# Altium schematic sheet power.SchDoc: Daughterboard Power
size A; DrawnBy: Mike Mozingo; Engineer: Mike Mozingo; Revision: 1
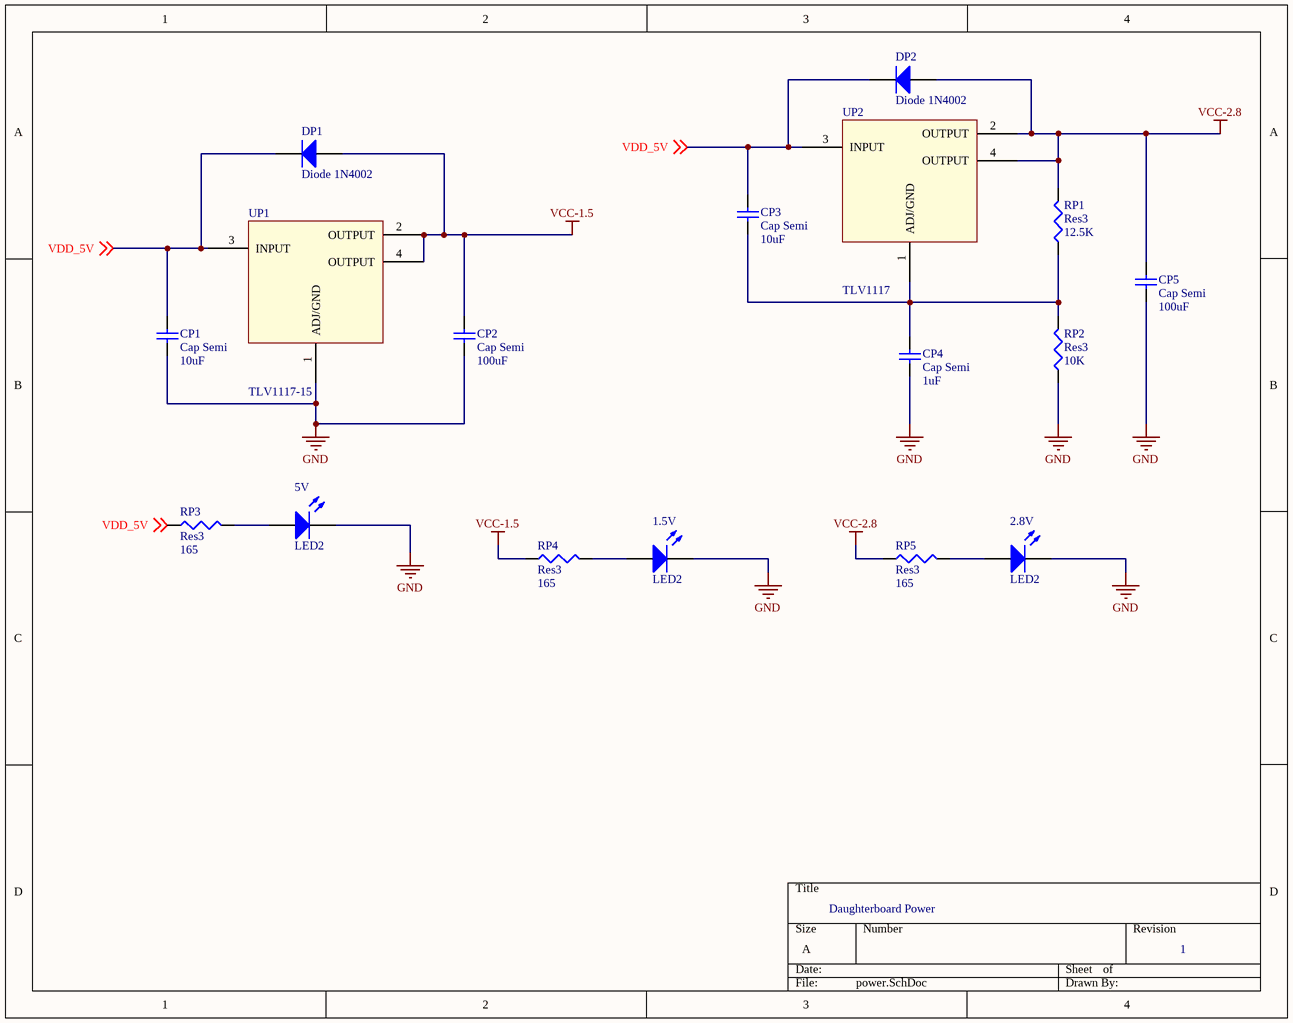
[diagram p0: power.SchDoc]

## Parts
1.5V  LED2  [DIODE1608]
2.8V  LED2  [DIODE1608]
5V  LED2  [DIODE1608]
CP1  Cap Semi  value 10uF  [CAPC1608L]
CP2  Cap Semi  value 100uF  [CAPC1608L]
CP3  Cap Semi  value 10uF  [CAPC1608L]
CP4  Cap Semi  value 1uF  [CAPC1608L]
CP5  Cap Semi  value 100uF  [CAPC1608L]
DP1  Diode 1N4002  [DIO10.46-5.3x2.8]
DP2  Diode 1N4002  [DIO10.46-5.3x2.8]
RP1  Res3  value 12.5K  [RESC1608L]
RP2  Res3  value 10K  [RESC1608L]
RP3  Res3  value 165  [RESC1608L]
RP4  Res3  value 165  [RESC1608L]
RP5  Res3  value 165  [RESC1608L]
UP1  TLV1117-15  [TLV1117-DCY]
UP2  TLV1117  [TLV1117-DCY]

## Nets
GND: 1.5V.2(K) 2.8V.2(K) 5V.2(K) CP1.1 CP2.1 CP4.1 CP5.1 RP2.1 UP1.1(ADJ/GND)
VCC-1.5: CP2.2 DP1.1(A) RP4.1 UP1.2(OUTPUT) UP1.4(OUTPUT)
VCC-2.8: CP5.2 DP2.1(A) RP1.2 RP5.1 UP2.2(OUTPUT) UP2.4(OUTPUT)
VDD_5V: CP1.2 CP3.2 DP1.2(K) DP2.2(K) RP3.1 UP1.3(INPUT) UP2.3(INPUT) ; off-sheet VDD_5V
Net1.5V_1: 1.5V.1(A) RP4.2
Net2.8V_1: 2.8V.1(A) RP5.2
Net5V_1: 5V.1(A) RP3.2
NetCP3_1: CP3.1 CP4.2 RP1.1 RP2.2 UP2.1(ADJ/GND)

## Library data of the parts
1.5V 2.8V 5V = LED2: Typical RED, GREEN, YELLOW, AMBER GaAs LED; Published: 8-Jun-2000; LatestRevisionDate: 17-Jul-2002; LatestRevisionNote: Re-released for DXP Platform.; PackageVersion: Feb-2002; PackageReference: 3.2X1.6X1.1; Publisher: Altium Limited; Color: Blue
CP1-CP5 = Cap Semi: Capacitor (Semiconductor SIM Model); Published: 8-Jun-2000; LatestRevisionDate: 29-May-2009; LatestRevisionNote: IPC-7351 Footprint Added.; PackageReference: C1206; Publisher: Altium Limited; PackageDescription: Chip Capacitor
  CP1-CP3 CP5: Type: Tantalum
DP1 DP2 = Diode 1N4002: 1 Amp General Purpose Rectifier; Published: 8-Jun-2000; LatestRevisionDate: 17-Jul-2002; LatestRevisionNote: Re-released for DXP Platform.; DatasheetVersion: 1998; PackageVersion: Aug-1999; PackageReference: DO-41; Publisher: Altium Limited; Code_JEDEC: DO-204-AL; ComponentLink1Description: Manufacturer Link; ComponentLink1URL: http://www.fairchildsemi.com/; ComponentLink2Description: Datasheet; ComponentLink2URL: http://www.fairchildsemi.com/ds/1N%2F1N4001.pdf
RP1-RP5 = Res3: Resistor; Published: 8-Jun-2000; LatestRevisionDate: 29-May-2009; LatestRevisionNote: IPC-7351 Footprint Added.; PackageReference: J1-0603; Publisher: Altium Limited; PackageDescription: Chip Resistor
UP1 = TLV1117